# Altium project SleepDream_V2.PrjPcb
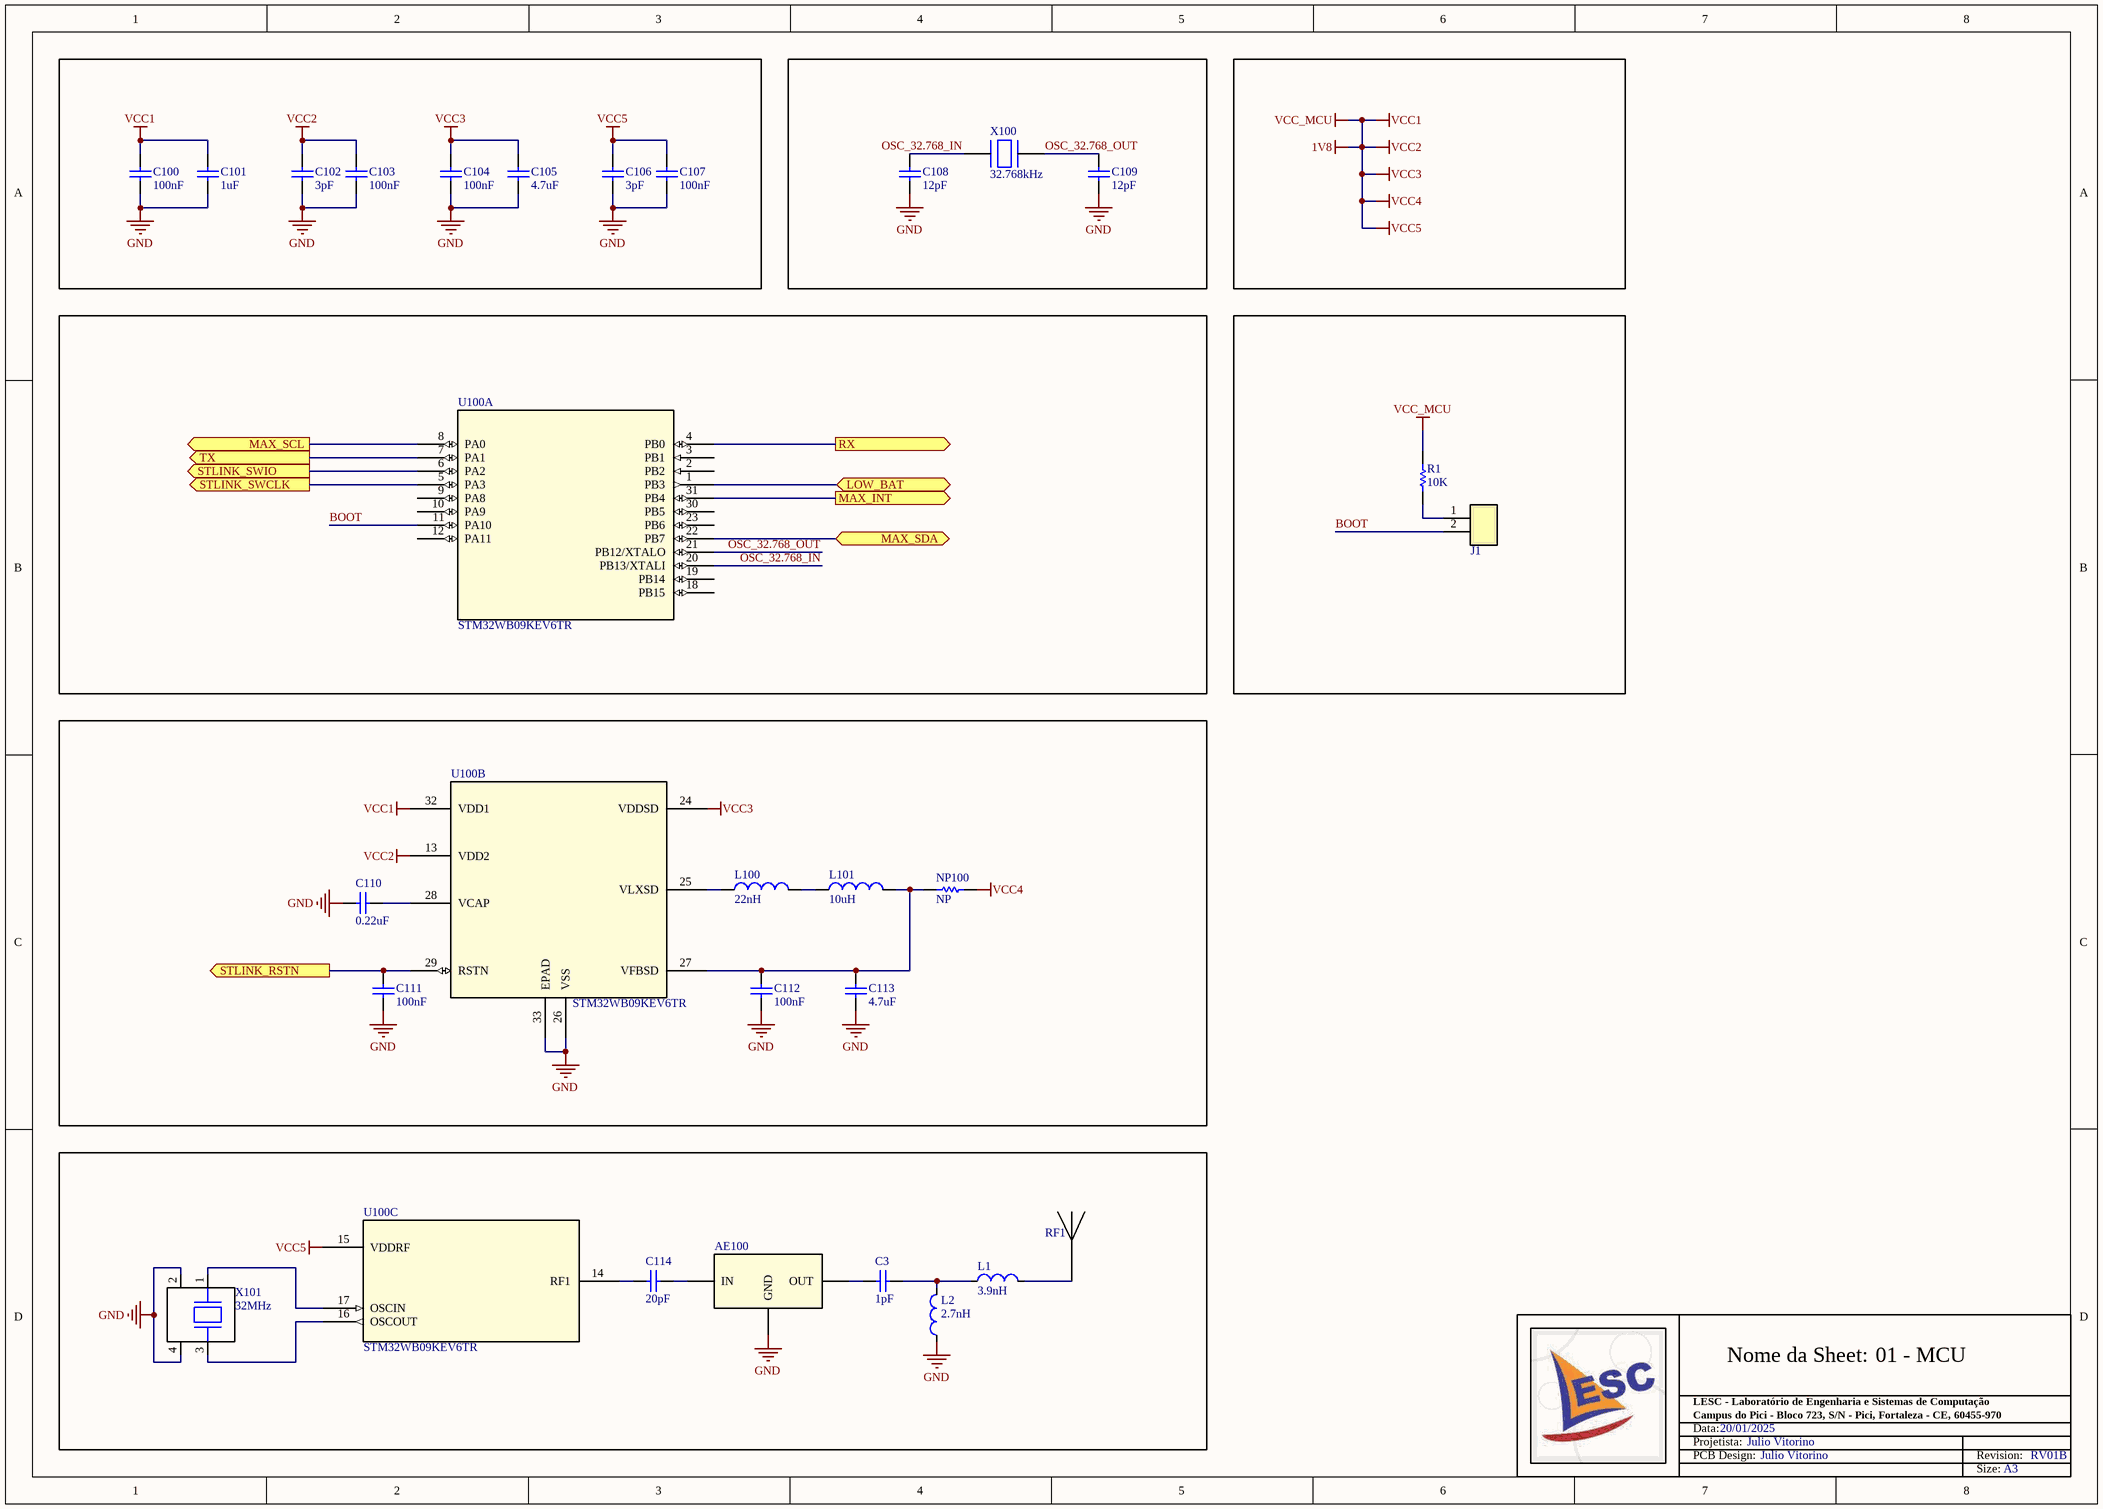
[diagram p0: 01 - MCU.SchDoc]
5 sheets, 78 parts. Net scope: flat (ports and power ports of the same name join across sheets).
Board file: PCB1.PcbDoc
Sheets:
  01 - MCU.SchDoc
  02 - WIRELESS_CHARGE.SchDoc
  03 - POWER SUPLY.SchDoc
  04 - OXIMETER.SchDoc
  05 - CONNECTOR.SchDoc

## Sheet 01 - MCU.SchDoc
size A3; SheetNumber: 1; SheetTotal: 5; Data: 20/01/2025; Revisão: RV01B; Papel: A3; Nome da Sheet: 01 - MCU

### Parts
AE100  RF FILTER LOW PASS 2.45GHZ 6SMD  [MLPF-WB55-01E3_STM]  (value not drawn)
C3  value 1pF  [0402-C-R-RF]  (hidden comment: GJM1555C1HR90WB01D)
C100  value 100nF  [0402-C-R]  (hidden comment: C0402C104K8RACTU)
C101  value 1uF  [0402-C-R]  (hidden comment: GRM155R61E105KA12D)
C102  value 3pF  [0402-C-R]  (hidden comment: C0402C104K8RACTU)
C103  value 100nF  [0402-C-R]  (hidden comment: C0402C104K8RACTU)
C104  value 100nF  [0402-C-R]  (hidden comment: C0402C104K8RACTU)
C105  value 4.7uF  [0402-C-R]  (hidden comment: GRM155R61A475MEAAD)
C106  value 3pF  [0402-C-R]  (hidden comment: C0402C104K8RACTU)
C107  value 100nF  [0402-C-R]  (hidden comment: C0402C104K8RACTU)
C108  value 12pF  [0402-C-R]  (hidden comment: GCM1555C1H120FA16J)
C109  value 12pF  [0402-C-R]  (hidden comment: GCM1555C1H120FA16J)
C110  value 0.22uF  [0402-C-R]  (hidden comment: C0402C104K8RACTU)
C111  value 100nF  [0402-C-R]  (hidden comment: C0402C104K8RACTU)
C112  value 100nF  [0402-C-R]  (hidden comment: C0402C104K8RACTU)
C113  value 4.7uF  [0402-C-R]  (hidden comment: GRM155R61A475MEAAD)
C114  value 20pF  [0201-C-R-RF]  (hidden comment: C0402C104K8RACTU)
J1  CONN HEADER SMD 2POS 1.27MM  [HARWIN_M50-3630242]  (value not drawn)
L1  value 3.9nH  [0402-R-L -RF]  (hidden comment: IND 3.9NH 300MA 170MOHM SM_1)
L2  value 2.7nH  [0402-R-L -RF]  (hidden comment: IND 2.7NH 300MA 170MOHM SM)
L100  IND: 22nH  [0402-R-L]  (hidden comment: IND 22NH 350MA 0.58OHM SMD)
L101  IND: 10uH  [0805-R-L]  (hidden comment: IND 10UH 300MA 680MOHM SMD)
NP100  NP  [0402-R-NP]
R1  value 10K  [0402-R-R]  (hidden comment: RMCF0402FT10K0)
RF1  RF ANT 2.4GHZ CHIP SOLDER SMD  [XCVR_2450AT18A0100001E]  (value not drawn)
U100  PN: STM32WB09KEV6TR  [VFQFPN-32_5x5x1mm_STM]  (hidden comment: IC ULTRA-LOW-POWER, ARM CORTEX-M0+)  (parts A,B,C of 3)
X100  value 32.768kHz  [XTAL_ECS-.327-12.5-34RR-TR]  (hidden comment: ECX-.327-CDX-1293)
X101  FRQ: 32MHz  [XTAL_ECS-320-8-37-CKM-TR3]  (hidden comment: ECS-320-8-37-CKM-TR3)

### Ports
LOW_BAT (bidir), MAX_INT (out), MAX_SCL (out), MAX_SDA (bidir), RX (out), STLINK_RSTN (out), STLINK_SWCLK (out), STLINK_SWIO (out), TX (out)

### Nets
1V8: C100.2 C101.2 C102.2 C103.2 C104.2 C105.2 C106.2 C107.2 NP100.2 R1.2 U100.13(VDD2) U100.15(VDDRF) U100.24(VDDSD) U100.32(VDD1)  [also labelled VCC1, VCC2, VCC3, VCC4, VCC5, VCC_MCU]
GND: AE100.2,4,5,6(GND) C100.1 C101.1 C102.1 C103.1 C104.1 C105.1 C106.1 C107.1 C108.1 C109.1 C110.1 C111.1 C112.1 C113.1 L2.1 U100.26(VSS) U100.33(EPAD) X101.2(GND) X101.4(GND)
BOOT: J1.2 U100.11(PA10)
OSC_32.768_IN: C108.2 U100.20(PB13/XTALI) X100.1(P$1)
OSC_32.768_OUT: C109.2 U100.21(PB12/XTALO) X100.2(P$2)
NetAE100_1: AE100.1(OUT) C3.1
NetAE100_3: AE100.3(IN) C114.2
NetC3_2: C3.2 L1.1 L2.2
NetC110_2: C110.2 U100.28(VCAP)
NetC111_2: C111.2 U100.29(RSTN) ; port STLINK_RSTN
NetC112_2: C112.2 C113.2 L101.1 NP100.1 U100.27(VFBSD)
NetC114_1: C114.1 U100.14(RF1)
NetJ1_1: J1.1 R1.1
NetJ2_2: U100.6(PA2) ; port STLINK_SWIO
NetJ2_3: U100.5(PA3) ; port STLINK_SWCLK
NetJ3_1: U100.4(PB0) ; port RX
NetJ3_2: U100.7(PA1) ; port TX
NetL1_2: L1.2 RF1.1
NetL100_1: L100.1 L101.2
NetL100_2: L100.2 U100.25(VLXSD)
NetR400_1: U100.31(PB4) ; port MAX_INT
NetR401_1: U100.8(PA0) ; port MAX_SCL
NetR402_1: U100.22(PB7) ; port MAX_SDA
NetTP4_1: U100.1(PB3) ; port LOW_BAT
NetU100_16: U100.16(OSCOUT) X101.3
NetU100_17: U100.17(OSCIN) X101.1

Not connected (* = marked no-connect by the designer): U100 2(PB2) 3(PB1) 9(PA8) 10(PA9) 12(PA11) 18(PB15) 19(PB14) 23(PB6) 30(PB5)

### Notes on the sheet
- Nome da Sheet:
- Data:
- Projetista:
- PCB Design:
- LESC - Laboratório de Engenharia e Sistemas de Computação
- Campus do Pici - Bloco 723, S/N - Pici, Fortaleza - CE, 60455-970
- Julio Vitorino
- Revision:
- Size:

### Library data of the parts
AE100 = RF FILTER LOW PASS 2.45GHZ 6SMD: 2.45GHz Center Frequency Low Pass RF Filter (Radio Frequency) 100MHz Bandwidth 1.1dB 6-SMD, No Lead PN: MLPF-WB55-01E3; Mfr_Name: STMicroelectronics; RefDes: RefDes; Type: Type; PN: MLPF-WB55-01E3
C3 = CAP SMD 1PF 50V C0G/NP0 0402: CAP CER 1PF 50V C0G/NP0 0402 PN: QSCF500Q1R0B1GV001T; TOLERANCE: 20%; SIZE: 0402; VOLTAGE: 50V; PN: QSCF500Q1R0B1GV001T
C100 C103 C104 C107 C111 C112 = CAP SMD 0402 100nF 10V ±20%: CAP SMD 0402 MLCC GERAL 100nF 10V ±20% 0402 X7R PN:C0402C104K8RACTU KEMET; SIZE: 0402; VOLTAGE: 10V; TOLERANCE: 20%; PN: C0402C104K8RACTU
C101 = CAP SMD 0402 1uF 25V ±10%: CAP SMD 0402 MLCC GERAL 1uF 25V ±10% 0402 X5R PN:GRM155R61E105KA12D MURATA; SIZE: 0402; VOLTAGE: 25V; TOLERANCE: 10%; PN: GRM155R61E105KA12D
C102 C106 = CAP SMD 0402 3pF 50V ±0.1pF: CAP CER 3PF 50V C0G/NP0 0402 PN: 0402N3R0B500CT; TOLERANCE: ±0.1pF; SIZE: 0402; VOLTAGE: 50V; PN: 0402N3R0B500CT
C105 C113 = CAP SMD 0402 4.7uF 10V ±20%: CAP SMD 0402 MLCC GERAL 4.7uF 10V ±20% 0402 X5R PN:GRM155R61A475MEAAD MURATA; SIZE: 0402; VOLTAGE: 10V; TOLERANCE: 20%; PN: GRM155R61A475MEAAD
C108 C109 = CAP SMD 0402 12pF 50V ±1%: CAP SMD CER 12pF 50V ±1% 0402 C0G,NP0 TAPE PN: GCM1555C1H120FA16J; POWER: 50V; TOLERANCE: 1%; PN: GCM1555C1H120FA16J
C110 = CAP SMD 0402 0.22uF 6.3V ±10%: CAP SMD 0402 MLCC GERAL 0.22u 6.3V ±10% 0402 X5R PN: CC0402KRX5R5BB224; SIZE: 0402; VOLTAGE: 6.3V; TOLERANCE: 10%; PN: CC0402KRX5R5BB224
C114 = CAP SMD 0201 20pF 25V ±2%: 20 pF ±2% 25V Ceramic Capacitor C0G, NP0 0201 PN: GJM0335C1E200GB01D; SIZE: 0201; VOLTAGE: 25V; TOLERANCE: 2%; PN: GJM0335C1E200GB01D
J1 = CONN HEADER SMD 2POS 1.27MM: Connector Header Surface Mount 2 position 0.050" (1.27mm) PN: M50-3630242; MF: {'manufacturer': u'Harwin Inc.'}; Package: None; Price: None; Value: *; PN: M50-3630242; Availability: Unavailable
L1 = IND 3.9NH 300MA 170MOHM SM_1: IND 3.9NH 300MA 170MOHM SM PN: LRC0402CS3N9GV001T; MF: Murata Electronics; PN: LRC0402CS3N9GV001T; Package: 1608 ICS; DigiKey-Purchase-URL: https://snapeda.com/shop?store=DigiKey&id=4221634; Mouser-Purchase-URL: https://snapeda.com/shop?store=Mouser&id=4221634; SnapEDA_Link: https://www.snapeda.com/parts/DFE18SAN1R0ME0L/Applied%20Avionics/view-part/4221634/?ref=snap
L2 = IND 2.7NH 300MA 170MOHM SM: IND 2.7NH 300MA 170MOHM SM PN: LRC0402CS2N7GV001T; MF: Murata Electronics; PN: LRC0402CS2N7GV001T; Package: 1608 ICS; DigiKey-Purchase-URL: https://snapeda.com/shop?store=DigiKey&id=4221634; Mouser-Purchase-URL: https://snapeda.com/shop?store=Mouser&id=4221634; SnapEDA_Link: https://www.snapeda.com/parts/DFE18SAN1R0ME0L/Applied%20Avionics/view-part/4221634/?ref=snap
L100 = IND 22NH 350MA 0.58OHM SMD: IND 22NH 350MA 0.58OHM SMD PN: LQG15HN22NJ02D; Part Number: DFE18SAN1R0ME0L; MF: Murata Electronics; PN: LQG15HN22NJ02D; Package: 1608 ICS; DigiKey-Purchase-URL: https://snapeda.com/shop?store=DigiKey&id=4221634; Value: *; Mouser-Purchase-URL: https://snapeda.com/shop?store=Mouser&id=4221634; SnapEDA_Link: https://www.snapeda.com/parts/DFE18SAN1R0ME0L/Applied%20Avionics/view-part/4221634/?ref=snap
L101 = IND 10UH 300MA 680MOHM SMD: FIXED IND 10UH 300MA 680MOHM SMDPN: MLZ2012M100HT000; Part Number: DFE18SAN1R0ME0L; MF: Murata Electronics; PN: MLZ2012M100HT000; Package: 1608 ICS; DigiKey-Purchase-URL: https://snapeda.com/shop?store=DigiKey&id=4221634; Value: *; Mouser-Purchase-URL: https://snapeda.com/shop?store=Mouser&id=4221634; SnapEDA_Link: https://www.snapeda.com/parts/DFE18SAN1R0ME0L/Applied%20Avionics/view-part/4221634/?ref=snap
NP100 = RES SMD 0402 NP: PACK: 0402; VALUE: NP
R1 = RES SMD 0402 10K 0.063W ±1%: RES SMD GERAL FILM 10K 0.063W ±1% 0402 7" TAPE PN: RMCF0402FT10K0 STACKPOLE; PACK: 0402; POWER: 0.063W; TOLERANCE: 1%; PN: RMCF0402FT10K0
RF1 = RF ANT 2.4GHZ CHIP SOLDER SMD: 2.4GHz Chip RF Antenna 2.4GHz ~ 2.5GHz 0.5dBi Solder Surface Mount PN: 2450AT18A0100001E; MF: Johanson; SnapEDA_Link: https://www.snapeda.com/parts/2450AT18A0100001E/AN/view-part/?ref=snap; Package: None; Value: *; PN: 2450AT18A0100001E; Check_prices: https://www.snapeda.com/parts/2450AT18A0100001E/AN/view-part/?ref=eda
U100 = IC ULTRA-LOW-POWER, ARM CORTEX-M0+: IC RF TxRx + MCU Bluetooth Bluetooth v5.4 32-VFQFN PN: STM32WB09KEV6TR; Mfr_Name: STMicroelectronics; RefDes: RefDes; Type: Type
X100 = CRYSTAL 32.768kHZ 12.5pF  SMD: MF: ECS Inc.; PN: ECX-.327-CDX-1293; Digi-Key_Part_Number: XC2292CT-ND; Package: SMD-2 ECS International; Digi-Key_Purchase_URL: https://www.digikey.in/product-detail/en/ecs-inc/ECX-.327-CDX-1293/XC2292CT-ND/6821660?utm_source=snapeda&utm_medium=aggregator&utm_campaign=symbol; SnapEDA_Link: https://www.snapeda.com/parts/ECX-.327-CDX-1293/ECS%20Inc./view-part/1733917/?ref=snap; Parameter 1: *
X101 = CRYSTAL 32.0000MHZ 8PF SMD: 32 MHz ±10ppm Crystal 8pF 60 Ohms 4-SMD, No Lead PN: ECS-320-8-37-CKM-TR3; MF: Abracon LLC; Price: None; SnapEDA_Link: https://www.snapeda.com/parts/ABM12-48.000MHZ-B2X-T3/Abracon+LLC/view-part/?ref=snap; Purchase-URL: https://pricing.snapeda.com/search/part/ABM12-48.000MHZ-B2X-T3/?ref=eda; Package: SMD-4 Abracon LLC; Availability: In Stock; PN: ECS-320-8-37-CKM-TR3; Check_prices: https://www.snapeda.com/parts/ABM12-48.000MHZ-B2X-T3/Abracon+LLC/view-part/?ref=eda

## Sheet 02 - WIRELESS_CHARGE.SchDoc
size A4; SheetNumber: 2; SheetTotal: 5; Nome da Sheet: 02 - WIRELESS_CHA; Data: 20/01/2025; Revisão: RV01B
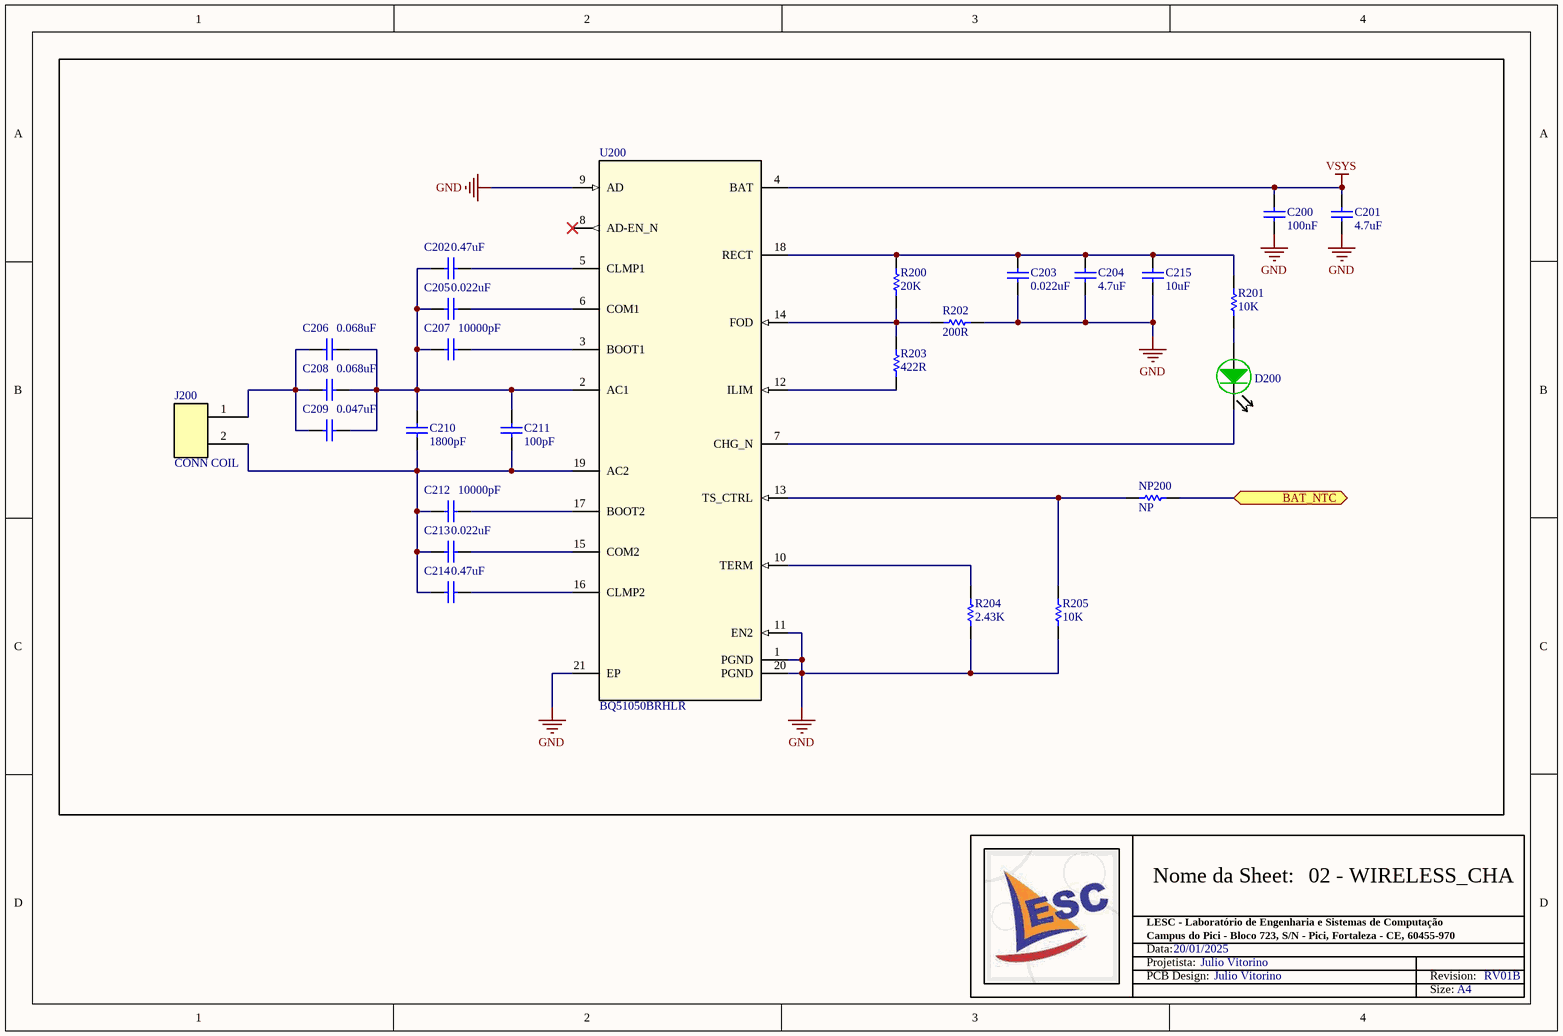
[diagram p1: 02 - WIRELESS_CHARGE.SchDoc]

### Parts
C200  value 100nF  [0402-C-R]  (hidden comment: C0402C104K8RACTU)
C201  value 4.7uF  [0402-C-R]  (hidden comment: GRM155R61A475MEAAD)
C202  value 0.47uF  [0402-C-R]  (hidden comment: GRM155R61H474KE11D)
C203  value 0.022uF  [0402-C-R]  (hidden comment: GCM155R71H223KA55D)
C204  value 4.7uF  [0402-C-R]  (hidden comment: GRM155R61A475MEAAD)
C205  value 0.022uF  [0402-C-R]  (hidden comment: GCM155R71H223KA55D)
C206  value 0.068uF  [0402-C-R]  (hidden comment: GCM155R71H683KE02D)
C207  value 10000pF  [0402-C-R]  (hidden comment: GCM155R71H103KA55D)
C208  value 0.068uF  [0402-C-R]  (hidden comment: GCM155R71H683KE02D)
C209  value 0.047uF  [0402-C-R]  (hidden comment: GCM155R71H473KE02D)
C210  value 1800pF  [0402-C-R]  (hidden comment: GRM1555C1H182JA01D)
C211  value 100pF  [0402-C-R]  (hidden comment: GRM1555C1H101JA01D)
C212  value 10000pF  [0402-C-R]  (hidden comment: GCM155R71H103KA55D)
C213  value 0.022uF  [0402-C-R]  (hidden comment: GCM155R71H223KA55D)
C214  value 0.47uF  [0402-C-R]  (hidden comment: GRM155R61H474KE11D)
C215  value 10uF  [0603-C-R]  (hidden comment: CAP SMD 0603 10uF 10V ±10%)
D200  150060GS75000  [LED0603]  (value not drawn)
J200  CONN COIL  [CONNECTOR COIL]
NP200  NP  [0402-R-NP]
R200  value 20K  [0402-R-R]  (hidden comment: RMCF0402FT20K0)
R201  value 10K  [0402-R-R]  (hidden comment: RMCF0402FT10K0)
R202  value 200R  [0402-R-R]  (hidden comment: RMCF0402JT200R)
R203  value 422R  [0402-R-R]  (hidden comment: RMCF0402FT422R)
R204  value 2.43K  [0402-R-R]  (hidden comment: RMCF0402FT2K43)
R205  value 10K  [0402-R-R]  (hidden comment: RMCF0402FT10K0)
U200  BQ51050BRHLR  [RHL0020A]

### Ports
BAT_NTC (bidir)

### Nets
GND: C200.1 C201.1 C203.1 C204.1 C215.1 R202.1 R204.1 R205.1 U200.1(PGND) U200.9(AD) U200.11(EN2) U200.20(PGND) U200.21(EP)
VSYS: C200.2 C201.2 U200.4(BAT)
NetC202_1: C202.1 C205.1 C206.2 C207.1 C208.2 C209.2 C210.2 C211.2 U200.2(AC1)
NetC202_2: C202.2 U200.5(CLMP1)
NetC203_2: C203.2 C204.2 C215.2 R200.1 R201.2 U200.18(RECT)
NetC205_2: C205.2 U200.6(COM1)
NetC206_1: C206.1 C208.1 C209.1 J200.1
NetC207_2: C207.2 U200.3(BOOT1)
NetC210_1: C210.1 C211.1 C212.1 C213.1 C214.1 J200.2 U200.19(AC2)
NetC212_2: C212.2 U200.17(BOOT2)
NetC213_2: C213.2 U200.15(COM2)
NetC214_2: C214.2 U200.16(CLMP2)
NetD200_1: D200.1(K) U200.7(CHG_N)
NetD200_2: D200.2(A) R201.1
NetJ602_2: NP200.2 ; port BAT_NTC
NetNP200_1: NP200.1 R205.2 U200.13(TS_CTRL)
NetR200_2: R200.2 R202.2 R203.2 U200.14(FOD)
NetR203_1: R203.1 U200.12(ILIM)
NetR204_2: R204.2 U200.10(TERM)

Not connected (* = marked no-connect by the designer): U200 8(AD-EN_N)*

### Notes on the sheet
- LESC - Laboratório de Engenharia e Sistemas de Computação
- Nome da Sheet:
- Data:
- Projetista:
- PCB Design:
- Campus do Pici - Bloco 723, S/N - Pici, Fortaleza - CE, 60455-970
- Julio Vitorino
- Revision:
- Size:
- A4

### Library data of the parts
C200 = CAP SMD 0402 100nF 10V ±20%: as C100 on sheet 01 - MCU; SIZE: 0402; VOLTAGE: 10V; TOLERANCE: 20%; PN: C0402C104K8RACTU
C201 C204 = CAP SMD 0402 4.7uF 10V ±20%: as C105 on sheet 01 - MCU; SIZE: 0402; VOLTAGE: 10V; TOLERANCE: 20%; PN: GRM155R61A475MEAAD
C202 C214 = CAP SMD 0402 0.47uF 50V ±10%: CAP CER  0.47uF 50V X7R 0402 PN: GRM155R61H474KE11D; TOLERANCE: 10%; POWER: 50V; PN: GRM155R61H474KE11D
C203 C205 C213 = CAP SMD 0402 0.022uF 50V ±10%: CAP CER  0.022uF 50V X7R 0402 PN: GCM155R71H223KA55D; TOLERANCE: 10%; POWER: 50V; PN: GCM155R71H223KA55D
C206 C208 = CAP SMD 0402 0.068uF 50V ±10%: CAP CER 0.068uF 50V X7R 0402 PN: GCM155R71H683KE02D; TOLERANCE: 10%; POWER: 50V; PN: GCM155R71H683KE02D
C207 C212 = CAP SMD 0402 10000pF 50V ±10%: CAP CER 10000PF 50V X7R 0402 PN: GCM155R71H103KA55D; TOLERANCE: 10%; POWER: 50V; PN: GCM155R71H103KA55D
C209 = CAP SMD 0402 0.047uF 50V ±10%: CAP CER  0.047uF 50V X7R 0402 PN: GCM155R71H473KE02D; TOLERANCE: 10%; POWER: 50V; PN: GCM155R71H473KE02D
C210 = CAP SMD 0402 1800pF 50V ±5%: CAP CER 1800PF 50V C0G/NP0 0402 PN: GRM1555C1H182JA01D; TOLERANCE: 5%; POWER: 50V; PN: GRM1555C1H182JA01D
C211 = CAP SMD 0402 100pF 50V ±5%: CAP SMD CER 100pF 50V ±5% 0402 C0G,NP0 TAPE PN: GRM1555C1H101JA01D; TOLERANCE: 1%; POWER: 50V; PN: GRM1555C1H101JA01D
C215 = CAP SMD 0603 10uF 10V ±10%: CAP SMD 0603 MLCC GERAL 10uF 10V ±10% X7R PN: GRM188Z71A106KA73D; SIZE: 0603; PN: GRM188Z71A106KA73D; VOLTAGE: 10V; TOLERANCE: 10%
D200 = LED SMD VD 0603: LED SMD VD ALTO BRILHO 1,6x0,8x0,8mm 430mcd PN:150060GS75000 0603 WURTH; ID: ?; PN: 150060GS75000
J200 = CONN COIL: COIL CONNECTOR
NP200 = RES SMD 0402 NP: PACK: 0402; VALUE: NP
R200 = RES SMD 0402 20K 0.063W ±1%: RES SMD GERAL FILM 20K 0.063W ±1% 0402 7" TAPE PN: RMCF0402FT20K0 STACKPOLE; PACK: 0402; POWER: 0.063W; TOLERANCE: 1%; PN: RMCF0402FT20K0
R201 R205 = RES SMD 0402 10K 0.063W ±1%: as R1 on sheet 01 - MCU; POWER: 0.063W; TOLERANCE: 1%; PN: RMCF0402FT10K0
R202 = RES SMD 0402 200R 0.063W ±1%: RES SMD GERAL FILM 200R 0.063W ±1% 0402 7" TAPE PN: RMCF0402JT200R STACKPOLE; PACK: 0402; POWER: 0.063W; TOLERANCE: 1%; PN: RMCF0402JT200R
R203 = RES SMD 0402 422R 0.063W ±1%: RES SMD GERAL FILM 422R 0.063W ±1% 0402 7" TAPE PN: RMCF0402FT422R STACKPOLE; PACK: 0402; POWER: 0.063W; TOLERANCE: 1%; PN: RMCF0402FT422R
R204 = RES SMD 0402 2.43K 0.063W ±1%: RES SMD GERAL FILM 2.43K 0.063W ±1% 0402 7" TAPE PN: RMCF0402FT2K43 STACKPOLE; PACK: 0402; POWER: 0.063W; TOLERANCE: 1%; PN: RMCF0402FT2K43
U200 = IC WIRELESS PWR RCVR 20QFN: Wireless Power Receiver PMIC 20-VQFN (3.5x4.5) PN: BQ51050BRHLR; Mfr_Name: Texas Instruments; TYPE: TYPE; RefDes: RefDes; PN: BQ51050BRHLR

## Sheet 03 - POWER SUPLY.SchDoc
size A4; Date: 20/01/2025; SheetNumber: 3; SheetTotal: 5; Nome da Sheet: 03 - POWER SUPLY; Data: 20/01/2025; Revisão: RV01B
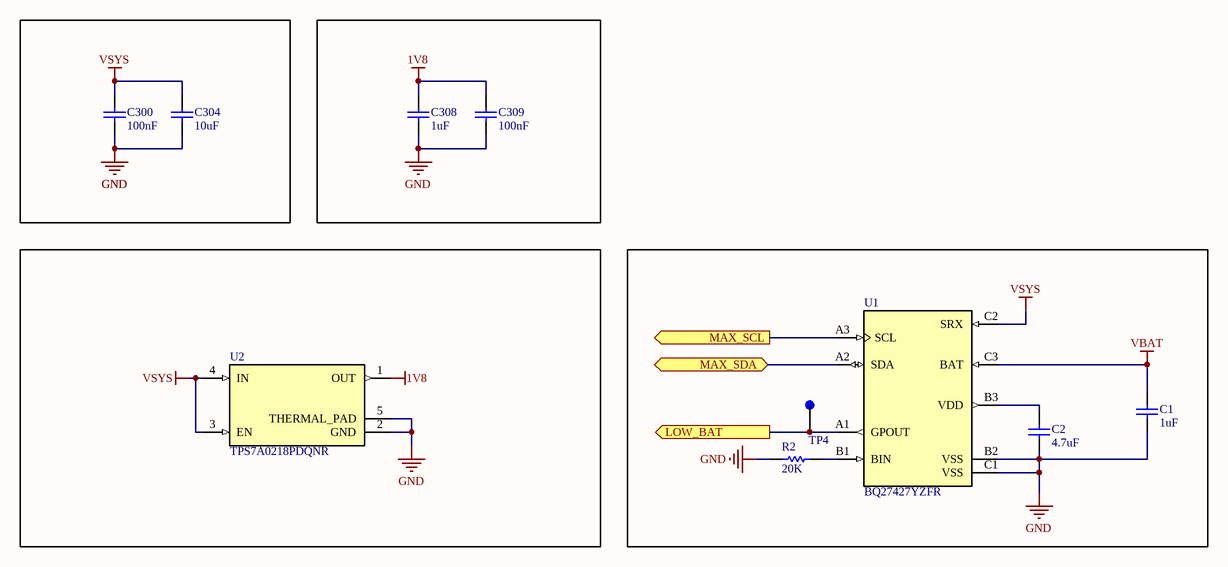
[diagram p2: 03 - POWER SUPLY.SchDoc]

### Parts
C1  value 1uF  [0402-C-R]  (hidden comment: GRM155R61E105KA12D)
C2  value 4.7uF  [0402-C-R]  (hidden comment: GRM155R61A475MEAAD)
C300  value 100nF  [0402-C-R]  (hidden comment: C0402C104K8RACTU)
C304  value 10uF  [0603-C-R]  (hidden comment: CAP SMD 0603 10uF 10V ±10%)
C308  value 1uF  [0402-C-R]  (hidden comment: GRM155R61E105KA12D)
C309  value 100nF  [0402-C-R]  (hidden comment: C0402C104K8RACTU)
R2  value 20K  [0402-R-R]  (hidden comment: RMCF0402FT20K0)
TP4  TEST POINT SMD  [TP SMD]  (value not drawn)
U1  PN: BQ27427YZFR  [IC_BQ27427YZFR]  (hidden comment: IC SINGLE-CELL BATTERY FUEL GAUGE W)
U2  PN: TPS7A0218PDQNR  [IC_TPS7A0218PDQNR]  (hidden comment: IC REG LINEAR 1.8V 200MA 4-X2SON)

### Ports
LOW_BAT (out), MAX_SCL (out), MAX_SDA (bidir)

### Nets
1V8: C308.2 C309.2 U2.1(OUT)
GND: C1.1 C2.1 C300.1 C304.1 C308.1 C309.1 R2.1 U1.B2(VSS) U1.C1(VSS) U2.2(GND) U2.5(THERMAL_PAD)
VBAT: C1.2 U1.C3(BAT)
VSYS: C300.2 C304.2 U1.C2(SRX) U2.3(EN) U2.4(IN)
NetC2_2: C2.2 U1.B3(VDD)
NetR2_2: R2.2 U1.B1(BIN)
NetR401_1: U1.A3(SCL) ; port MAX_SCL
NetR402_1: U1.A2(SDA) ; port MAX_SDA
NetTP4_1: TP4.1(TP) U1.A1(GPOUT) ; port LOW_BAT

### Notes on the sheet
- LESC - Laboratório de Engenharia e Sistemas de Computação
- Nome da Sheet:
- Data:
- Projetista:
- PCB Design:
- Campus do Pici - Bloco 723, S/N - Pici, Fortaleza - CE, 60455-970
- Julio Vitorino
- Revision:
- Size:
- A4

### Library data of the parts
C1 C308 = CAP SMD 0402 1uF 25V ±10%: as C101 on sheet 01 - MCU; SIZE: 0402; VOLTAGE: 25V; TOLERANCE: 10%; PN: GRM155R61E105KA12D
C2 = CAP SMD 0402 4.7uF 10V ±20%: as C105 on sheet 01 - MCU; SIZE: 0402; VOLTAGE: 10V; TOLERANCE: 20%; PN: GRM155R61A475MEAAD
C300 C309 = CAP SMD 0402 100nF 10V ±20%: as C100 on sheet 01 - MCU; SIZE: 0402; VOLTAGE: 10V; TOLERANCE: 20%; PN: C0402C104K8RACTU
C304 = CAP SMD 0603 10uF 10V ±10%: as C215 on sheet 02 - WIRELESS_CHARGE; SIZE: 0603; PN: GRM188Z71A106KA73D; VOLTAGE: 10V; TOLERANCE: 10%
R2 = RES SMD 0402 20K 0.063W ±1%: as R200 on sheet 02 - WIRELESS_CHARGE; POWER: 0.063W; TOLERANCE: 1%; PN: RMCF0402FT20K0
U1 = IC SINGLE-CELL BATTERY FUEL GAUGE W: Battery Fuel Gauge IC Lithium Ion 9-DSBGA PN: BQ27427YZFR; MF: Texas Instruments; Availability: In Stock; Package: None; Value: *; Purchase-URL: https://pricing.snapeda.com/search/part/BQ27427YZFR/?ref=eda; SnapEDA_Link: https://www.snapeda.com/parts/BQ27427YZFR/Texas+Instruments/view-part/?ref=snap; Price: None; Check_prices: https://www.snapeda.com/parts/BQ27427YZFR/Texas+Instruments/view-part/?ref=eda
U2 = IC REG LINEAR 1.8V 200MA 4-X2SON: Linear Voltage Regulator IC Positive Fixed 1 Output 200mA 4-X2SON (1x1) PN: TPS7A0218PDQNR; MF: {'manufacturer': u'Texas Instruments'}; Package: None; Price: None; Value: *; Availability: Unavailable

## Sheet 04 - OXIMETER.SchDoc
size A4; Date: 20/01/2025; SheetNumber: 4; SheetTotal: 5; Data: 20/01/2025; Revisão: RV01B; Nome da Sheet: 04 - OXIMETER
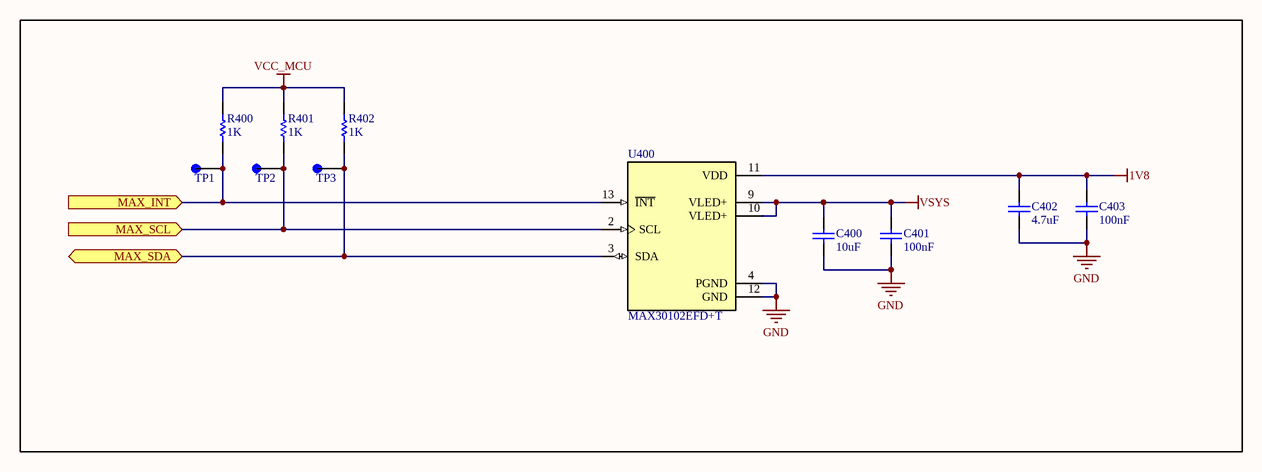
[diagram p3: 04 - OXIMETER.SchDoc]

### Parts
C400  value 10uF  [0603-C-R]  (hidden comment: CAP SMD 0603 10uF 10V ±10%)
C401  value 100nF  [0402-C-R]  (hidden comment: C0402C104K8RACTU)
C402  value 4.7uF  [0402-C-R]  (hidden comment: GRM155R61A475MEAAD)
C403  value 100nF  [0402-C-R]  (hidden comment: C0402C104K8RACTU)
R400  value 1K  [0402-R-R]  (hidden comment: RMCF0402FT1K00)
R401  value 1K  [0402-R-R]  (hidden comment: RMCF0402FT1K00)
R402  value 1K  [0402-R-R]  (hidden comment: RMCF0402FT1K00)
TP1  TEST POINT SMD  [TP SMD]  (value not drawn)
TP2  TEST POINT SMD  [TP SMD]  (value not drawn)
TP3  TEST POINT SMD  [TP SMD]  (value not drawn)
U400  PN: MAX30102EFD+T  [XDCR_MAX30101EFD+]  (hidden comment: IC SENSOR OXIMETER/HEART RATE I2C)

### Ports
MAX_INT (in), MAX_SCL (in), MAX_SDA (bidir)

### Nets
1V8: C402.2 C403.2 R400.2 R401.2 R402.2 U400.11(VDD)  [also labelled VCC_MCU]
GND: C400.1 C401.1 C402.1 C403.1 U400.4(PGND) U400.12(GND)
VSYS: C400.2 C401.2 U400.9(VLED+) U400.10(VLED+)
NetR400_1: R400.1 TP1.1(TP) U400.13(~{INT}) ; port MAX_INT
NetR401_1: R401.1 TP2.1(TP) U400.2(SCL) ; port MAX_SCL
NetR402_1: R402.1 TP3.1(TP) U400.3(SDA) ; port MAX_SDA

### Notes on the sheet
- LESC - Laboratório de Engenharia e Sistemas de Computação
- Nome da Sheet:
- Data:
- Projetista:
- PCB Design:
- Campus do Pici - Bloco 723, S/N - Pici, Fortaleza - CE, 60455-970
- Julio Vitorino
- Revision:
- Size:
- A4

### Library data of the parts
C400 = CAP SMD 0603 10uF 10V ±10%: as C215 on sheet 02 - WIRELESS_CHARGE; SIZE: 0603; PN: GRM188Z71A106KA73D; VOLTAGE: 10V; TOLERANCE: 10%
C401 C403 = CAP SMD 0402 100nF 10V ±20%: as C100 on sheet 01 - MCU; SIZE: 0402; VOLTAGE: 10V; TOLERANCE: 20%; PN: C0402C104K8RACTU
C402 = CAP SMD 0402 4.7uF 10V ±20%: as C105 on sheet 01 - MCU; SIZE: 0402; VOLTAGE: 10V; TOLERANCE: 20%; PN: GRM155R61A475MEAAD
R400-R402 = RES SMD 0402 1K 0.063W ±1%: RES SMD GERAL FILM 1K 0.063W ±1% 0402 7" TAPE PN: RMCF0402FT1K00 STACKPOLE; PACK: 0402; TOLERANCE: 1%; POWER: 0.063W; PN: RMCF0402FT1K00
U400 = IC SENSOR OXIMETER/HEART RATE I2C: IC SENSOR OXIMETER/HEART RATE I2C PN: MAX30102EFD+T; MF: Maxim Integrated Products; Digi-Key_Part_Number: MAX30102EFD+TTR-ND; Check_prices: https://www.snapeda.com/parts/MAX30102EFD+T/Maxim+Integrated/view-part/?ref=eda; Package: None; SnapEDA_Link: https://www.snapeda.com/parts/MAX30102EFD+T/Maxim+Integrated/view-part/?ref=snap; Value: *; Purchase-URL: https://pricing.snapeda.com/search/part/MAX30102EFD+T/?ref=eda

## Sheet 05 - CONNECTOR.SchDoc
size A4; Date: 20/01/2025; SheetNumber: 5; SheetTotal: 5; Nome da Sheet: 06 - CONNECTOR; Data: 20/01/2025; Revisão: RV01B
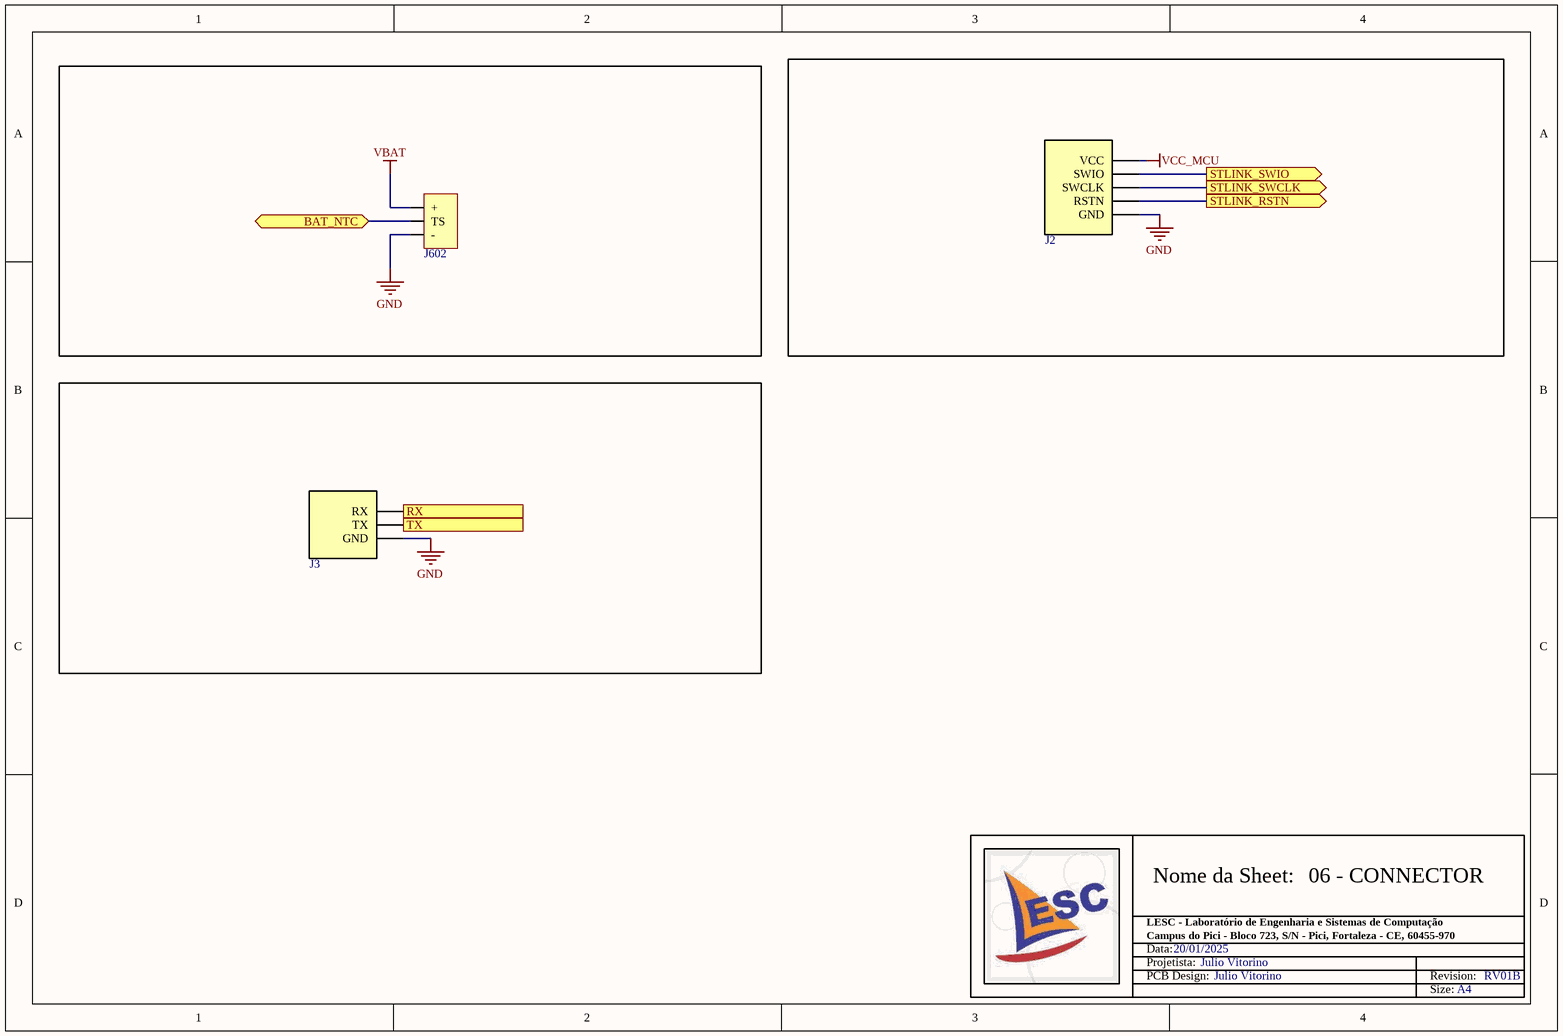
[diagram p4: 05 - CONNECTOR.SchDoc]

### Parts
J2  CONN PCB 5PIN  [SWD CONNECTOR]  (value not drawn)
J3  CONN PCB 3PIN  [DEBUG CONNECTOR]  (value not drawn)
J602  10114830-11103LF  [CONNECTOR BATTERY]  (value not drawn)

### Ports
BAT_NTC (bidir), RX (out), STLINK_RSTN (out), STLINK_SWCLK (out), STLINK_SWIO (out), TX (out)

### Nets
GND: J2.5(GND) J3.3(GND) J602.1(-)
VBAT: J602.3(+)
VCC_MCU: J2.1(VCC)  [project net 1V8]
NetC111_2: J2.4(RSTN) ; port STLINK_RSTN
NetJ2_2: J2.2(SWIO) ; port STLINK_SWIO
NetJ2_3: J2.3(SWCLK) ; port STLINK_SWCLK
NetJ3_1: J3.1(RX) ; port RX
NetJ3_2: J3.2(TX) ; port TX
NetJ602_2: J602.2(TS) ; port BAT_NTC

### Notes on the sheet
- LESC - Laboratório de Engenharia e Sistemas de Computação
- Nome da Sheet:
- Data:
- Projetista:
- PCB Design:
- Campus do Pici - Bloco 723, S/N - Pici, Fortaleza - CE, 60455-970
- Julio Vitorino
- Revision:
- Size:
- A4

### Library data of the parts
J602 = CONN HEADER SMD R/A 3POS 1.25MM: Manufacturer: Amphenol ICC; eVendor Part#: 609-10114830-11103LFCT-ND; eVendor: Digikey; eVendor Price: 0,48; MSRP: 0,27254; PN: 10114830-11103LF; MOQ: 500; NP: *

## Nets that join several sheets
1V8: 01 - MCU (14 pins), 03 - POWER SUPLY (C308.2 C309.2 U2.1), 04 - OXIMETER (6 pins), 05 - CONNECTOR (J2.1)
GND: 01 - MCU (20 pins), 02 - WIRELESS_CHARGE (13 pins), 03 - POWER SUPLY (11 pins), 04 - OXIMETER (6 pins), 05 - CONNECTOR (J2.5 J3.3 J602.1)
VBAT: 03 - POWER SUPLY (C1.2 U1.C3), 05 - CONNECTOR (J602.3)
VSYS: 02 - WIRELESS_CHARGE (C200.2 C201.2 U200.4), 03 - POWER SUPLY (5 pins), 04 - OXIMETER (C400.2 C401.2 U400.9 U400.10)
NetC111_2: 01 - MCU (C111.2 U100.29), 05 - CONNECTOR (J2.4)
NetJ2_2: 01 - MCU (U100.6), 05 - CONNECTOR (J2.2)
NetJ2_3: 01 - MCU (U100.5), 05 - CONNECTOR (J2.3)
NetJ3_1: 01 - MCU (U100.4), 05 - CONNECTOR (J3.1)
NetJ3_2: 01 - MCU (U100.7), 05 - CONNECTOR (J3.2)
NetJ602_2: 02 - WIRELESS_CHARGE (NP200.2), 05 - CONNECTOR (J602.2)
NetR400_1: 01 - MCU (U100.31), 04 - OXIMETER (R400.1 TP1.1 U400.13)
NetR401_1: 01 - MCU (U100.8), 03 - POWER SUPLY (U1.A3), 04 - OXIMETER (R401.1 TP2.1 U400.2)
NetR402_1: 01 - MCU (U100.22), 03 - POWER SUPLY (U1.A2), 04 - OXIMETER (R402.1 TP3.1 U400.3)
NetTP4_1: 01 - MCU (U100.1), 03 - POWER SUPLY (TP4.1 U1.A1)